# Altium schematic sheet Integrated_Main_Driver_Board-06-Power Supply Circuit -20230110.SchDoc
size A4
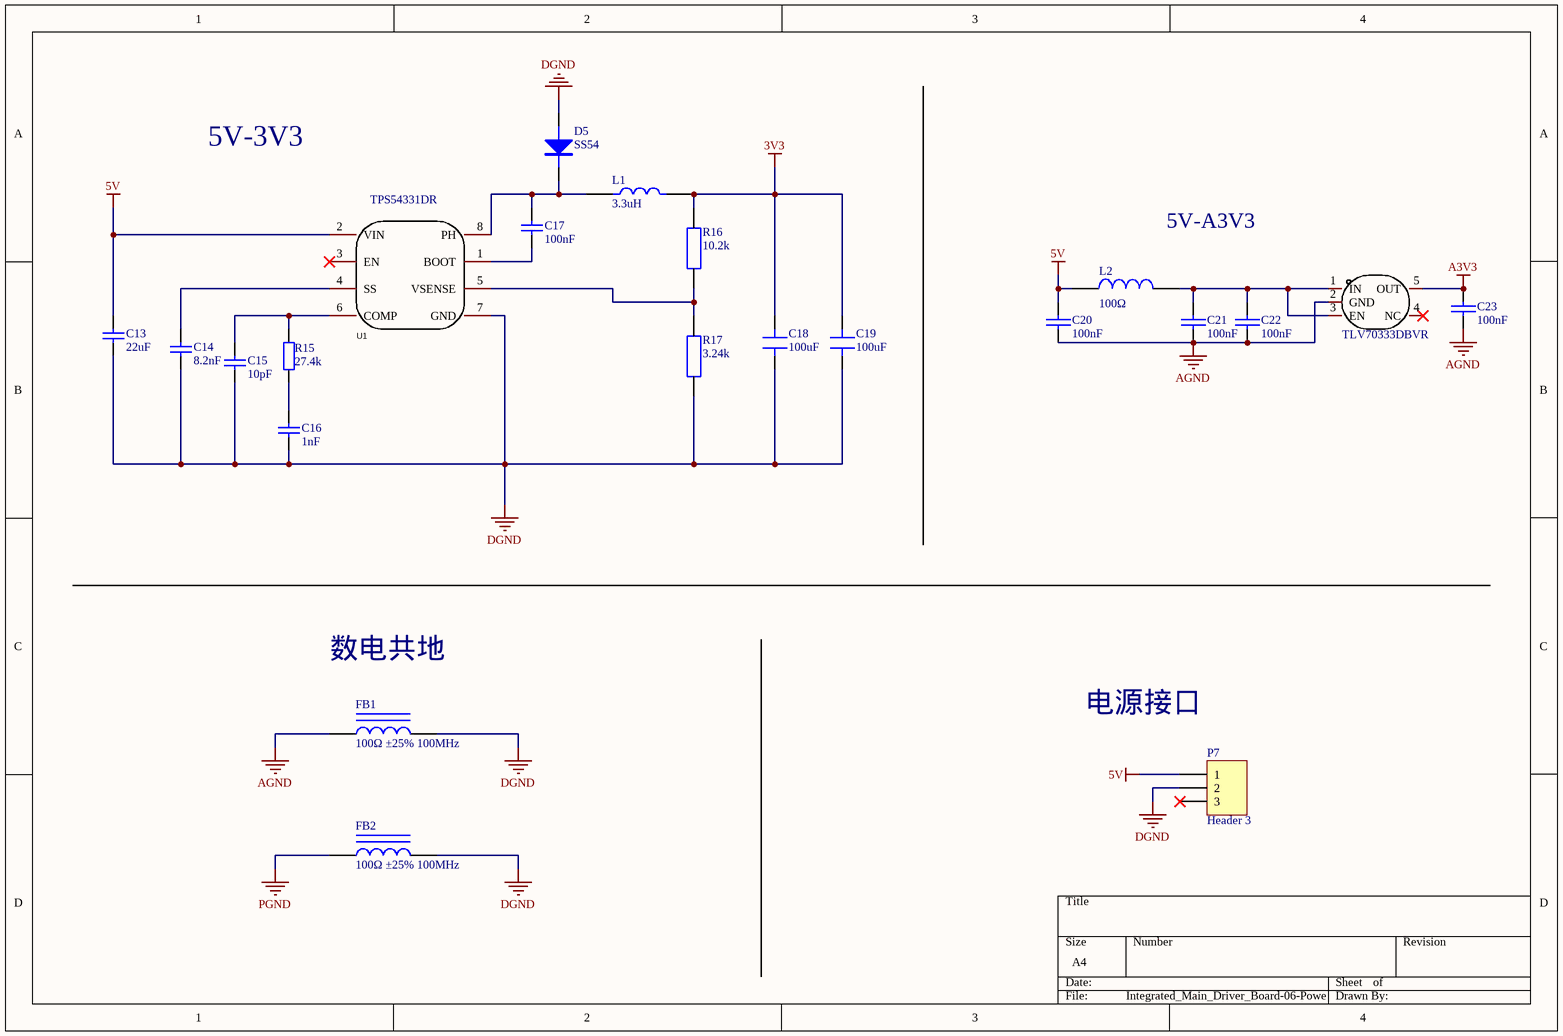
[diagram p0: Integrated_Main_Driver_Board-06-Power Supply Circuit -20230110.SchDoc]

## Parts
C13  22uF  [0805C]
C14  8.2nF  [0402C]
C15  10pF  [0402C]
C16  1nF  [0402C]
C17  100nF  [0402C]
C18  100uF  [1206C]
C19  100uF  [1206C]
C20  100nF  [0402C]
C21  100nF  [0402C]
C22  100nF  [0402C]
C23  100nF  [0402C]
D5  SS54  [DO-15]
FB1  100Ω ±25% 100MHz  [磁珠0402]
FB2  100Ω ±25% 100MHz  [磁珠0402]
L1  3.3uH  [0630L]
L2  100Ω  [0805L]
P7  Header 3  [3V-12V to 5.00V @ 3A]
R15  27.4k  [0402R]
R16  10.2k  [0402R]
R17  3.24k  [0402R]
U1  TPS54331DR  [TPS54331DR]
U2  TLV70333DBVR  [TLV70333]

## Nets
3V3: C18.2 C19.2 L1.2 R16.2
5V: C13.2 C20.2 L2.1 P7.1 U1.2(VIN)
A3V3: C23.2 U2.5(OUT)
AGND: C20.1 C21.1 C22.1 C23.1 FB1.1 U2.2(GND)
DGND: C13.1 C14.2 C15.1 C16.1 C18.1 C19.1 D5.A FB1.2 FB2.2 P7.2 R17.1 U1.7(GND)
PGND: FB2.1
NetC14_1: C14.1 U1.4(SS)
NetC15_2: C15.2 R15.2 U1.6(COMP)
NetC16_2: C16.2 R15.1
NetC17_1: C17.1 U1.1(BOOT)
NetC17_2: C17.2 D5.K L1.1 U1.8(PH)
NetC21_2: C21.2 C22.2 L2.2 U2.1(IN) U2.3(EN)
NetR16_1: R16.1 R17.2 U1.5(VSENSE)

Not connected (* = marked no-connect by the designer): P7 3*; U1 3(EN)*; U2 4(NC)*

## Notes on the sheet
- 5V-3V3
- 5V-A3V3
- 数电共地
- 电源接口

## Library data of the parts
C13 C15 C16 = 0805 10uF (106) 10% 25V: 贴片电容; ComponentLink1Description: 供应商链接; ComponentLink1URL: http://www.szlcsc.com/product/details_16532.html; Package: 0805; Supplier: LC; SuppliersPartNumber: C15850
C14 = 0805 2.0pF (2R0) 0.25pF 50V: 贴片电容; ComponentLink1Description: 供应商链接; ComponentLink1URL: http://www.szlcsc.com/product/details_2152.html; Package: 0805; Supplier: LC; SuppliersPartNumber: C1800
C17 = 0805 100nF(104) 10% 50V: 贴片电容; ComponentLink1Description: 供应商链接; ComponentLink1URL: http://www.szlcsc.com/product/details_50686.html; Package: 0805; Supplier: LC; SuppliersPartNumber: C49678
C18 C19 = 47uF 0805
C20-C23 = CAP: 无极性电容
D5 = DIODE: 普通二极管
FB1 FB2 = 0805 100Ω 25% 100MHz: 贴片磁珠; ComponentLink1Description: 供应商链接; ComponentLink1URL: http://www.szlcsc.com/product/details_1367.html; Package: 0805; Supplier: LC; SuppliersPartNumber: C1015
L1 = 15uH 电感
L2 = INDUCTOR
P7 = Header 3: Header, 3-Pin; LatestRevisionDate: 17-Jul-2002; LatestRevisionNote: Re-released for DXP Platform.; Publisher: Altium Limited
R15 = 0805 10MΩ (1005) 1%: 贴片电阻; ComponentLink1Description: 供应商链接; ComponentLink1URL: http://www.szlcsc.com/product/details_26851.html; Package: 0805; Supplier: LC; SuppliersPartNumber: C26108
R16 R17 = 10K 0805
U1 = TPS54331DR: Manufacturer: TI(德州仪器); Add into BOM: yes; Function: 降压型; Symbol: TPS54331DR; Device: TPS54331DR; LCSC Part Name: 降压型; Supplier Part: C9865; Manufacturer Part: TPS54331DR; Supplier Footprint: SOIC-8_150mil; JLCPCB Part Class: Basic Part; Datasheet: https://atta.szlcsc.com/upload/public/pdf/source/20121112/1457706556448.pdf; Supplier: LCSC; Convert to PCB: yes; Synchronous Rectification: -; Number of Outputs: -; Topology: -; Input Voltage: -; Output Current (Max): -; Switching Frequency: -
U2 = TLV70333DBVR: Manufacturer: TI(德州仪器); Add into BOM: yes; Output Type: 固定; Output Polarity: 正; Number of Outputs: 1; Maximum Input Voltage: 5.5V; Output Voltage: 3.3V; Dropout Voltage: 375mV@300mA; Quiescent Current (Ground Current): 55uA; Output Current: 300mA; Power Supply Rejection Ratio (PSRR): 68dB@(1kHz); Noise: 48uVrms; Name: TLV70333DBVR; Symbol: TLV70333DBVR; Device: TLV70333DBVR; LCSC Part Name: 正 Vin=5.5V Vout=3.3V 300mA 68dB@(1kHz); Supplier Part: C2871194; Manufacturer Part: TLV70333DBVR; Supplier Footprint: SOT-23; JLCPCB Part Class: Extended Part; Datasheet: https://atta.szlcsc.com/upload/public/pdf/source/20210918/50FD5D831AE9FE2A9E2303D8DCF0EFD5.pdf; Supplier: LCSC; Convert to PCB: yes; Feature: 过热保护,过流保护，使能; Operating Temperature: -55℃~+150℃@(Tj)